# Altium schematic sheet EEPROM.SchDoc
size A; DocumentNumber: 4; SheetNumber: 4; SheetTotal: 7
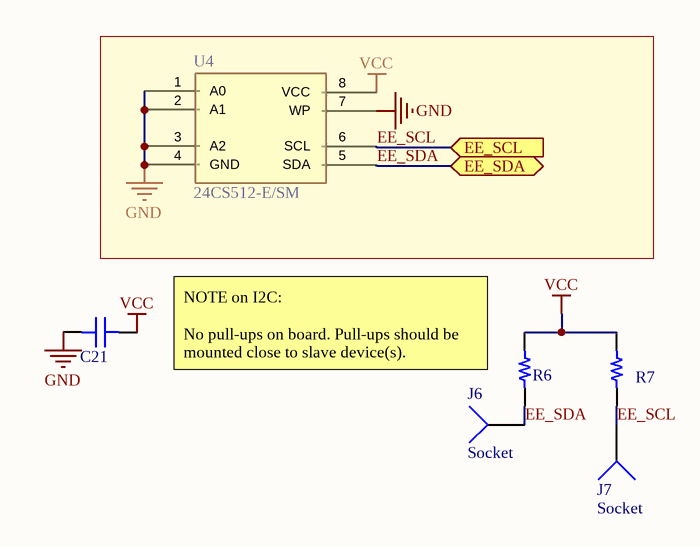
[diagram p0: EEPROM.SchDoc]

## Parts
C21  C0805C104M5RAC7025  [CAP SMD 0805]  (value not drawn)
J6  Socket  [PIN1]
J7  Socket  [PIN1]
R6  10K  [RES SMD 0805]  (value not drawn)
R7  10K  [RES SMD 0805]  (value not drawn)
U4  24CS512-E/SM  [21-0041B_8]

## Ports
EE_SCL (in), EE_SDA (bidir)

## Nets
GND: C21.1 U4.1(A0) U4.2(A1) U4.3(A2) U4.4(GND) U4.7(WP)
VCC: C21.2 R6.2 R7.2 U4.8(VCC)
EE_SCL: J7.1 R7.1 U4.6(SCL) ; port EE_SCL
EE_SDA: J6.1 R6.1 U4.5(SDA) ; port EE_SDA

## Notes on the sheet
- NOTE on I2C:
  No pull-ups on board. Pull-ups should be mounted close to slave device(s).

## Library data of the parts
C21 = CAPACITOR X7R: 0.1 µF ±20% 50V Ceramic Capacitor X7R 0805 (2012 Metric)
R6 R7 = RESISTOR: RES SMD 10K OHM 1% 1/4W 0805
U4 = AT24CW16X/24CW32X/24CW64X: EEPROM Memory IC 512Kb (64K x 8) I²C 3.4 MHz 400 ns 8-SOIJ
J6 J7 = Socket: LatestRevisionDate: 17-Jul-2002; LatestRevisionNote: Re-released for DXP Platform.; Publisher: Altium Limited